# Altium schematic sheet 01_ Title Page.SchDoc
size 420 x 297 mm
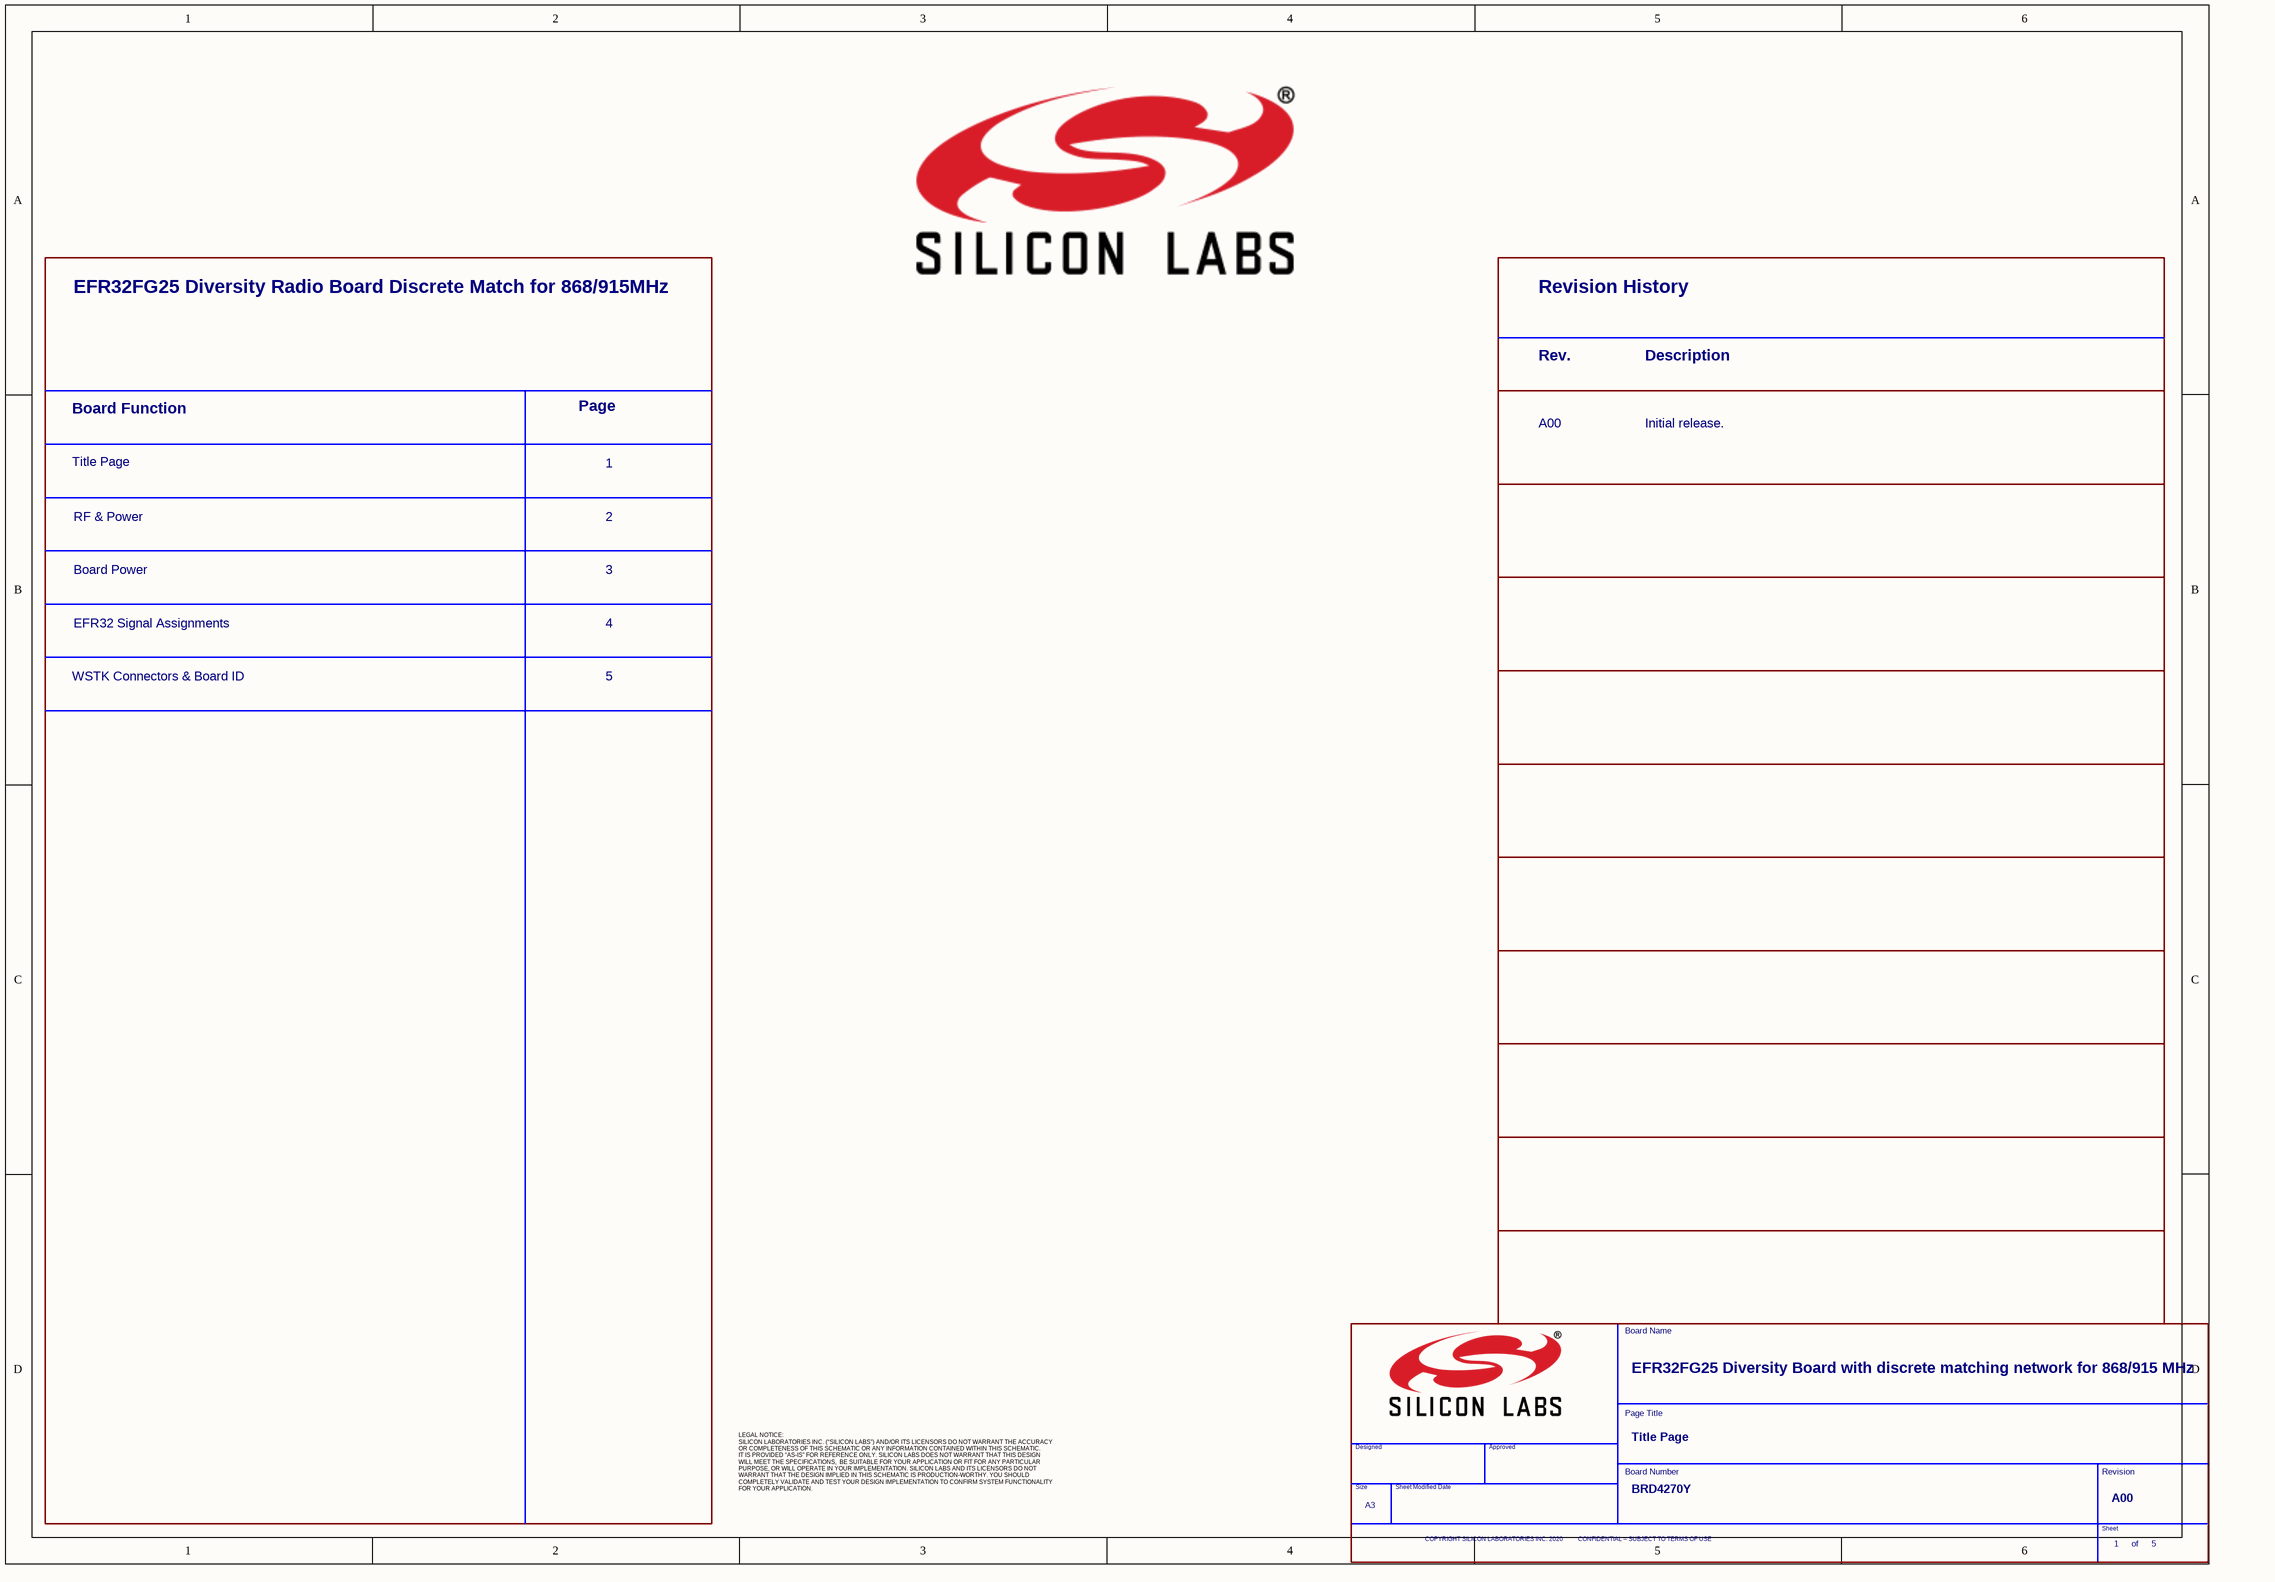
[diagram p0: 01_ Title Page.SchDoc]

## Parts
(Parts that share a designator on the sheet are numbered #1, #2 ... from top to bottom, then left to right.)
*#1  Header A: EFR32FG25 Diversity Radio Board Discrete Match for 868/915MHz  (hidden comment: Toc_Header)  (graphical)
*#2  Rev1: A00  Dscr1A: Initial release.  (hidden comment: Rev_History)  (graphical)
*#3  Title: EFR32FG25 Diversity Board with discrete matching network for 868/915 MHz  Page Count: 5  Page Number: 1  Page Size: A3  Page Title: Title Page  Board Number: BRD4270Y  RevCode: A00  (hidden comment: TitleBlock_SiliconLabs_A3)  (graphical)

## Notes on the sheet
- Board Function
- Page
- Title Page
- RF & Power
- 1
- 2
- Board Power
- 3
- EFR32 Signal Assignments
- 4
- WSTK Connectors & Board ID
- 5
- LEGAL NOTICE:
  SILICON LABORATORIES INC. (“SILICON LABS”) AND/OR ITS LICENSORS DO NOT WARRANT THE ACCURACY
  OR COMPLETENESS OF THIS SCHEMATIC OR ANY INFORMATION CONTAINED WITHIN THIS SCHEMATIC.
  IT IS PROVIDED “AS-IS” FOR REFERENCE ONLY. SILICON LABS DOES NOT WARRANT THAT THIS DESIGN
  WILL MEET THE SPECIFICATIONS,  BE SUITABLE FOR YOUR APPLICATION OR FIT FOR ANY PARTICULAR
  PURPOSE, OR WILL OPERATE IN YOUR IMPLEMENTATION. SILICON LABS AND ITS LICENSORS DO NOT
  WARRANT THAT THE DESIGN IMPLIED IN THIS SCHEMATIC IS PRODUCTION-WORTHY. YOU SHOULD
  COMPLETELY VALIDATE AND TEST YOUR DESIGN IMPLEMENTATION TO CONFIRM SYSTEM FUNCTIONALITY
  FOR YOUR APPLICATION.
- (in symbol Rev_History) Revision History; Rev.; Description
- (in symbol TitleBlock_SiliconLabs_A3) Board Name; Page Title; Designed; Approved; Board Number; Revision; Size; Sheet Modified Date; Sheet; COPYRIGHT SILICON LABORATORIES INC. 2020          CONFIDENTIAL – SUBJECT TO TERMS OF USE; of

## Library data of the parts
*#2 = Rev_History: RevCode: PA00*
*#3 = TitleBlock_SiliconLabs_A3: OrgName: Silicon Labs